# EAGLE design 2364 Multi-ROM Rev3 (EAGLE 9.7.0)
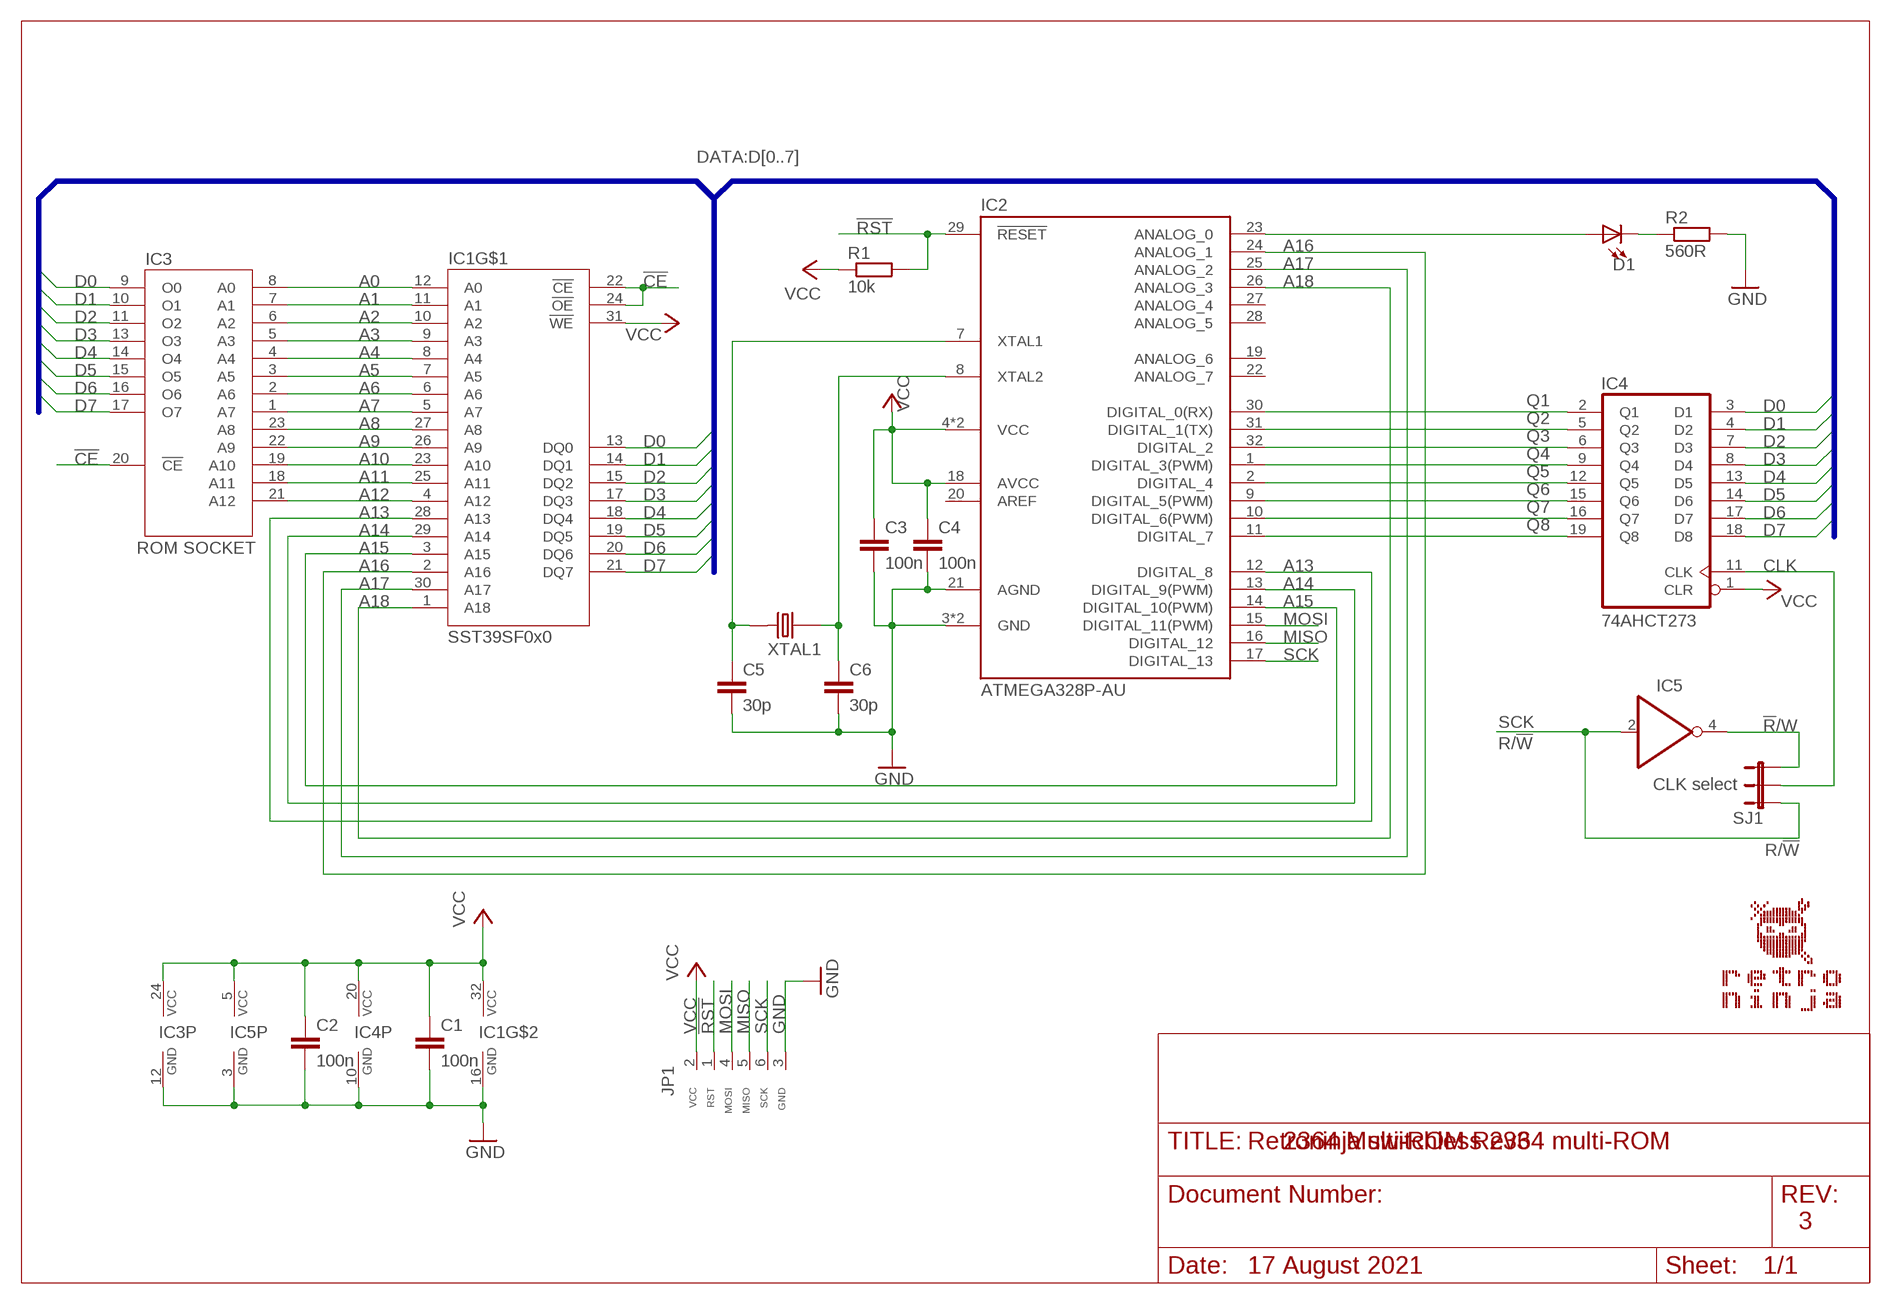
[diagram p0: schematic, sheet 1]

## Parts
C1  100n  C-EUC0805  [C0805]
C2  100n  C-EUC0805  [C0805]
C3  100n  C-EUC0805  [C0805]
C4  100n  C-EUC0805  [C0805]
C5  30p  C-EUC0805  [C0805]
C6  30p  C-EUC0805  [C0805]
D1  LED_0805  [LED0805]
IC1  SST39SF0x0  SST39XX040_PLCC_SHORT  [PLCC32_SHORT]
IC2  ATMEGA328P-AU  ARDUINO_168_328_TQFP  [TQFP32]
IC3  ROM SOCKET  2364_DOWNPINS  [DIL24-6_DOWNPINS]
IC4  74AHCT273  74273NS  [SO20]
IC5  741G04_SOT23  [SOT23-5]
JP1  ICSP_CONNECTOR_TL866_RIGHT2  [HEADER_1X6_RIGHT]
R1  10k  R-EU_R0805  [R0805]
R2  560R  R-EU_R0805  [R0805]
SJ1  JUMPER-3SJ  [SJ-3]
XTAL1  CRYSTAL  [CRYSTAL_SMD-2_7X4X2.3]

## Nets
!CE: IC1.22(!CE) IC1.24(!OE) IC3.20(!CE)
!R!/W: IC5.4(O) SJ1.3
!RST: IC2.29(!RESET) JP1.1(RST) R1.2
A0: IC1.12(A0) IC3.8(A0)
A1: IC1.11(A1) IC3.7(A1)
A2: IC1.10(A2) IC3.6(A2)
A3: IC1.9(A3) IC3.5(A3)
A4: IC1.8(A4) IC3.4(A4)
A5: IC1.7(A5) IC3.3(A5)
A6: IC1.6(A6) IC3.2(A6)
A7: IC1.5(A7) IC3.1(A7)
A8: IC1.27(A8) IC3.23(A8)
A9: IC1.26(A9) IC3.22(A9)
A10: IC1.23(A10) IC3.19(A10)
A11: IC1.25(A11) IC3.18(A11)
A12: IC1.4(A12) IC3.21(A12)
A13: IC1.28(A13) IC2.12(DIGITAL_8)
A14: IC1.29(A14) IC2.13(DIGITAL_9(PWM))
A15: IC1.3(A15) IC2.14(DIGITAL_10(PWM))
A16: IC1.2(A16) IC2.24(ANALOG_1)
A17: IC1.30(A17) IC2.25(ANALOG_2)
A18: IC1.1(A18) IC2.26(ANALOG_3)
CLK: IC4.11(CLK) SJ1.2
D0: IC1.13(DQ0) IC3.9(O0) IC4.3(D1)
D1: IC1.14(DQ1) IC3.10(O1) IC4.4(D2)
D2: IC1.15(DQ2) IC3.11(O2) IC4.7(D3)
D3: IC1.17(DQ3) IC3.13(O3) IC4.8(D4)
D4: IC1.18(DQ4) IC3.14(O4) IC4.13(D5)
D5: IC1.19(DQ5) IC3.15(O5) IC4.14(D6)
D6: IC1.20(DQ6) IC3.16(O6) IC4.17(D7)
D7: IC1.21(DQ7) IC3.17(O7) IC4.18(D8)
GND: C1.2 C2.2 C3.2 C4.2 C5.2 C6.2 IC1.16(GND) IC2.3(GND) IC2.5(GND) IC2.21(AGND) IC3.12(GND) IC4.10(GND) IC5.3(GND) JP1.3(GND) R2.2
MISO: IC2.16(DIGITAL_12) JP1.5(MISO)
MOSI: IC2.15(DIGITAL_11(PWM)) JP1.4(MOSI)
N$16: C6.1 IC2.8(XTAL2) XTAL1.1
N$17: C5.1 IC2.7(XTAL1) XTAL1.2
N$25: D1.A IC2.23(ANALOG_0)
N$26: D1.C R2.1
Q1: IC2.30(DIGITAL_0(RX)) IC4.2(Q1)
Q2: IC2.31(DIGITAL_1(TX)) IC4.5(Q2)
Q3: IC2.32(DIGITAL_2) IC4.6(Q3)
Q4: IC2.1(DIGITAL_3(PWM)) IC4.9(Q4)
Q5: IC2.2(DIGITAL_4) IC4.12(Q5)
Q6: IC2.9(DIGITAL_5(PWM)) IC4.15(Q6)
Q7: IC2.10(DIGITAL_6(PWM)) IC4.16(Q7)
Q8: IC2.11(DIGITAL_7) IC4.19(Q8)
SCK: IC2.17(DIGITAL_13) IC5.2(I) JP1.6(SCK) SJ1.1
VCC: C1.1 C2.1 C3.1 C4.1 IC1.31(!WE) IC1.32(VCC) IC2.4(VCC) IC2.6(VCC) IC2.18(AVCC) IC3.24(VCC) IC4.1(CLR) IC4.20(VCC) IC5.5(VCC) JP1.2(VCC) R1.1
Unconnected: IC2.19(ANALOG_6) IC2.20(AREF) IC2.22(ANALOG_7) IC2.27(ANALOG_4) IC2.28(ANALOG_5)

## Buses
DATA:D[0..7]

## Notes on the sheet
- R/!W
- CLK select
- R/!W
- Retroninja switchless 2364 multi-ROM
- 3
- 17 August 2021

## Library data of the parts
C1-C6 = rcl:C-EU: CAPACITOR, European symbol; SPICEPREFIX: C
D1 = Per (Fusion 360):LED
IC1 = Per (Fusion 360):SST39XX040
IC2 = Per (Fusion 360):ARDUINO_168_328
IC3 = Per (Fusion 360):2364
IC4 = Per (Fusion 360):74*273
IC5 = Per (Fusion 360):74*1G04
JP1 = Per (Fusion 360):ICSP_CONNECTOR: PIN HEADER
R1 R2 = rcl:R-EU_: RESISTOR, European symbol; SPICEPREFIX: R
SJ1 = Per (Fusion 360):JUMPER-3
XTAL1 = Per (Fusion 360):CRYSTAL

## Board
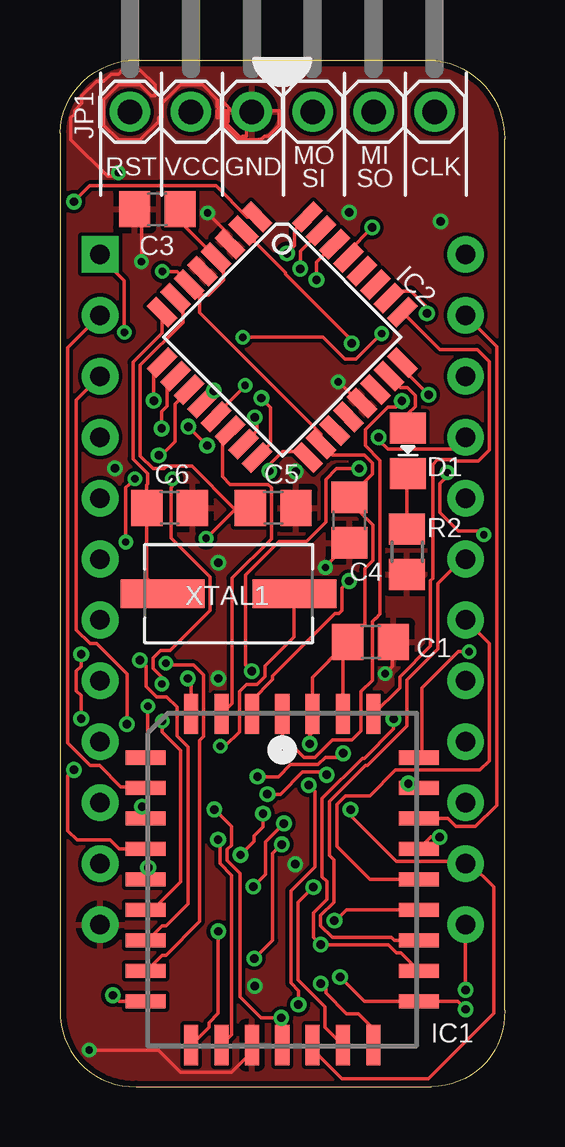
[diagram p1: board, top side]
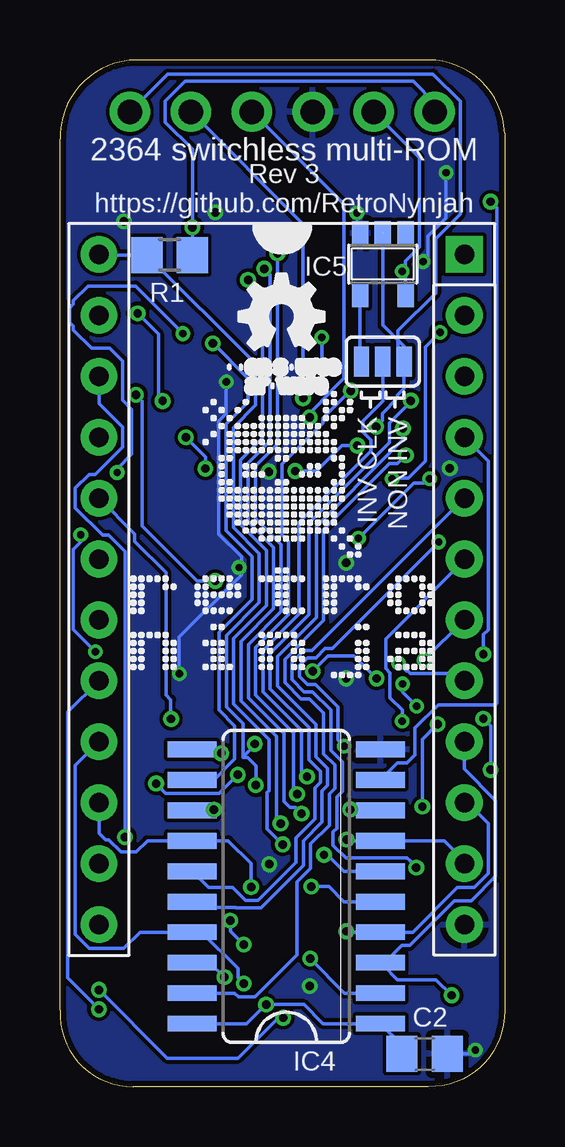
[diagram p2: board, bottom side, seen from below]

Size 18.54 x 42.8 mm. Coordinates in mm from the lower left corner, seen from the top.
Outline: 3.17,0 15.49,0 arc92 18.54,3.17 18.54,39.5 arc90 15.37,42.8 3.17,42.8 arc88 0,39.75 0,3.17 arc92 3.17,0
Copper layers (1*16): Top 0.035mm / dielectric 1.5mm / Bottom 0.035mm
Design rules "SeeedStudio_2layer_DRU_no_angle_20140221": minimum track width 6mil, minimum drill 12mil, track to track 6mil, track to pad 6mil, pad to pad 6mil, via to via 6mil, smd to smd 0mil, copper to edge 10mil, drill to drill 10mil, minimum pad ring 10mil, minimum via ring 6mil, stop-mask expansion 2mil, vias tented up to drill 100mil, thermal gap 10mil

### Footprints (pad centres in the part's own frame; a part is rotated, then mirrored left to right if it is on the bottom)
C0805 = smd 1.3 x 1.5: 1 -0.95,0; 2 0.95,0
LED0805 = smd 1.3 x 1.5: A -0.95,0; C 0.95,0
PLCC32_SHORT = smd 0.584 x 1.676: 1 0,6.9; 2 -1.27,6.9; 3 -2.54,6.9; 4 -3.81,6.9; 14 -3.81,-6.9; 15 -2.54,-6.9; 16 -1.27,-6.9; 17 0,-6.9; 18 1.27,-6.9; 19 2.54,-6.9; 20 3.81,-6.9; 30 3.81,6.9; 31 2.54,6.9; 32 1.27,6.9 | smd 1.676 x 0.584: 5 -5.7,5.08; 6 -5.7,3.81; 7 -5.7,2.54; 8 -5.7,1.27; 9 -5.7,0; 10 -5.7,-1.27; 11 -5.7,-2.54; 12 -5.7,-3.81; 13 -5.7,-5.08; 21 5.7,-5.08; 22 5.7,-3.81; 23 5.7,-2.54; 24 5.7,-1.27; 25 5.7,0; 26 5.7,1.27; 27 5.7,2.54; 28 5.7,3.81; 29 5.7,5.08
TQFP32 = smd 1.27 x 0.559: 1 -4.293,2.8; 2 -4.293,2; 3 -4.293,1.2; 4 -4.293,0.4; 5 -4.293,-0.4; 6 -4.293,-1.2; 7 -4.293,-2; 8 -4.293,-2.8; 17 4.293,-2.8; 18 4.293,-2; 19 4.293,-1.2; 20 4.293,-0.4; 21 4.293,0.4; 22 4.293,1.2; 23 4.293,2; 24 4.293,2.8 | smd 0.559 x 1.27: 9 -2.8,-4.293; 10 -2,-4.293; 11 -1.2,-4.293; 12 -0.4,-4.293; 13 0.4,-4.293; 14 1.2,-4.293; 15 2,-4.293; 16 2.8,-4.293; 25 2.8,4.293; 26 2,4.293; 27 1.2,4.293; 28 0.4,4.293; 29 -0.4,4.293; 30 -1.2,4.293; 31 -2,4.293; 32 -2.8,4.293
DIL24-6_DOWNPINS = drill 0.813 pad 1.524 square: 1 -15.24,-7.62 | drill 0.813 pad 1.524: 2 -12.7,-7.62; 3 -10.16,-7.62; 4 -7.62,-7.62; 5 -5.08,-7.62; 6 -2.54,-7.62; 7 0,-7.62; 8 2.54,-7.62; 9 5.08,-7.62; 10 7.62,-7.62; 11 10.16,-7.62; 12 12.7,-7.62; 13 12.7,7.62; 14 10.16,7.62; 15 7.62,7.62; 16 5.08,7.62; 17 2.54,7.62; 18 0,7.62; 19 -2.54,7.62; 20 -5.08,7.62; 21 -7.62,7.62; 22 -10.16,7.62; 23 -12.7,7.62; 24 -15.24,7.62
SO20 = smd 0.66 x 2.032: 1 -5.369,-4.019; 2 -4.099,-4.019; 3 -2.829,-4.019; 4 -1.559,-4.019; 5 -0.289,-4.019; 6 0.981,-4.019; 7 2.251,-4.019; 8 3.521,-4.019; 9 4.791,-4.019; 10 6.061,-4.019; 11 6.061,3.839; 12 4.791,3.839; 13 3.521,3.839; 14 2.251,3.839; 15 0.981,3.839; 16 -0.289,3.839; 17 -1.559,3.839; 18 -2.829,3.839; 19 -4.099,3.839; 20 -5.369,3.839
SOT23-5 = smd 0.69 x 0.99: 1 -0.95,-1.29; 2 0,-1.29; 3 0.95,-1.29; 4 0.95,1.3; 5 -0.95,1.3
HEADER_1X6_RIGHT = drill 1.016 pad 1.676: 1 -6.35,-1.27; 2 -3.81,-1.27; 3 -1.27,-1.27; 4 1.27,-1.27; 5 3.81,-1.27; 6 6.35,-1.27
R0805 = smd 1.3 x 1.5: 1 -0.95,0; 2 0.95,0
SJ-3 = smd 0.635 x 1.27: 1 -0.889,0; 2 0,0; 3 0.889,0
CRYSTAL_SMD-2_7X4X2.3 = smd 3.5 x 1.2: 1 -2.75,0; 2 2.75,0

### Placement (x,y rotation side)
C1  12.95,18.54 0 top
C2  3.34,1.36 0 bottom
C3  4.06,36.58 180 top
C4  12.06,23.62 270 top
C5  8.89,24.13 0 top
C6  4.57,24.13 0 top
D1  14.52,26.5 270 top
IC1  9.27,8.64 0 top
IC2  9.27,31.24 315 top
IC3  9.3,19.46 270 top
IC4  9.19,8 90 bottom
IC5  5.08,34.29 180 bottom
JP1  9.27,41.91 0 top
R1  13.97,34.67 0 bottom
R2  14.48,22.3 270 top
SJ1  5.08,30.23 180 bottom
U$1  [RETRONINJA_12MM]  15.62,17.02 0 bottom
U$2  [OSHW_5MM]  11.68,28.96 0 bottom
XTAL1  7.04,20.55 0 top

### Tracks (layer width: path | path; a pad name or v marks a point on that pad's centre or on a via)
!CE  (via drill 0.35)
  Top 0.152: IC1.22 14.22,5.58 14.04,5.58 13.7,5.92 v10.87,5.92 10.57,6.22 10.57,7.26 11.13,7.82 11.13,8.55 10.94,8.74 10.94,12.02 12.61,13.69 12.69,13.69 13.91,14.91 v13.91,15.33 | IC1.24 11.94,7.37 11.49,6.92 v11.45,6.92
  Bottom 0.152: IC3.20 15.42,23.04 15.42,22.73 14.12,21.43 14.12,16.32 13.93,16.13 13.93,15.35 v13.91,15.33 | v10.87,5.92 11.43,6.48 11.43,6.9 v11.45,6.92
!R!/W
  Bottom 0.152: SJ1.3 6.03,30.29 IC5.4
!RST  (via drill 0.35)
  Top 0.152: IC2.29 12.02,34.82 v13.02,35.81
  Bottom 0.152: R1.2 v13.02,35.81 13.02,39.07 14.15,40.2 14.15,41.08 13.32,41.91 3.81,41.91 2.92,41.02 JP1.1
A0  (via drill 0.3)
  Top 0.152: IC1.12 3.66,4.88 4.27,5.49 4.42,5.49 5.82,6.88 5.82,14.44 5.98,14.6 5.98,17.16 5.56,17.57 4.5,17.57 v4.42,17.65
  Bottom 0.152: IC3.8 1.98,17.22 3.92,17.22 4.02,17.32 4.1,17.32 v4.42,17.65
A1  (via drill 0.35)
  Top 0.152: IC1.11 3.66,6.1 4.27,6.71 4.42,6.71 5.33,7.62 5.33,14.17 4.88,14.63 4.88,15.82 4.45,16.26 4.02,16.26 3.58,16.7 3.58,17.53 v3.33,17.78
  Bottom 0.152: IC3.7 3.33,17.8 v3.33,17.78
A2  (via drill 0.3)
  Top 0.152: v4.27,15.24 4.27,14.78 5.03,14.02 5.03,8.53 3.96,7.47 3.66,7.47 IC1.10
  Bottom 0.152: v4.27,15.24 4.27,15.7 4.78,16.21 4.78,17.25 4.96,17.43 4.96,18.66 1.68,21.95 IC3.6
A3  (via drill 0.35)
  Top 0.152: v3.68,9.13 3.68,8.74 IC1.9
  Bottom 0.152: v3.68,9.13 3.93,9.38 3.93,9.41 4.07,9.54 6.62,9.54 7.15,10.07 7.15,10.62 7,10.78 7,12.08 6.77,12.31 6.77,13.53 7.25,14.01 7.25,15.7 8.01,16.46 8.36,16.46 8.86,16.97 8.86,17.68 8.36,18.18 8.03,18.18 IC3.5
A4  (via drill 0.35)
  Top 0.152: IC1.8 2.47,9.91 2.09,10.29 0.71,10.29 0.33,10.67 0.33,12.96 v0.58,13.21 | v0.89,15.34 0.89,16.31 0.69,16.51 0.69,17.33 0.89,17.53 v0.89,18.03
  Bottom 0.152: v0.89,15.34 0.58,15.04 v0.58,13.21 | v0.89,18.03 0.89,18.85 0.69,19.05 0.69,26.09 IC3.4
A5  (via drill 0.35)
  Top 0.152: IC1.7 3.43,11.32 v3.43,11.67 | IC3.3 0.69,28.63 0.69,19.05 1.27,18.47 1.53,18.47 2.79,17.2 v2.79,15.11
  Bottom 0.152: v3.43,11.67 3.43,14.48 v2.79,15.11
A6
  Top 0.152: IC1.6 3.5,12.5 2.54,12.5 1.65,13.39 1.27,13.39 0.33,14.32 0.33,30.81 IC3.2
A7  (via drill 0.3)
  Top 0.152: IC3.1 1.68,34.59 2.67,33.6 2.67,31.47 v2.69,31.45 | v4.68,25.34 4.68,25.01 4.64,24.98 4.64,22.87 6.26,21.25 6.26,19.86 4.59,18.18 4.2,18.18 3.89,17.87 3.89,17.43 4.25,17.07 v4.25,16.79 | IC1.5 3.66,13.8 3.66,15.85 v3.67,15.86
  Bottom 0.152: v4.68,25.34 4.64,25.38 4.01,25.38 3.3,26.09 3.3,30.84 v2.69,31.45 | v3.67,15.86 4.25,16.44 v4.25,16.79
A8
  Top 0.152: IC1.27 16.18,11.18 16.51,10.85 17.33,10.85 18.21,11.73 18.21,30.86 IC3.23
A9  (via drill 0.35)
  Top 0.152: IC1.26 15.47,10.4 v15.83,10.4
  Bottom 0.152: IC3.22 16.92,28.48 15.93,27.49 15.93,26.67 17.07,25.53 17.33,25.53 17.91,24.95 17.91,24.13 16.77,22.99 16.51,22.99 15.83,22.31 v15.83,10.4
A10
  Top 0.152: IC3.19 16.79,22 15.76,20.97 15.76,18.25 14.48,16.96 14.48,15.05 12.81,13.39 12.73,13.39 11.24,11.89 11.24,9.64 11.43,9.45 11.43,7.69 10.87,7.13 10.87,6.7 11.35,6.22 13.82,6.22 13.95,6.1 IC1.23
A11
  Top 0.152: IC3.18 17.91,18.47 17.91,13.59 17.51,13.2 13.99,13.2 12.93,12.13 11.9,12.13 11.55,11.77 11.55,10.01 12.92,8.64 IC1.25
A12  (via drill 0.35)
  Top 0.152: IC1.4 5.46,16.89 v5.33,17.02 | v8,17.32 7.75,17.57 7.75,21.34 9.14,22.73 10.29,22.73 11.09,23.53 11.09,25.32 11.54,25.77 v12.47,25.77 | v13.29,27.07 13.29,26.96 13.67,26.57 16.41,26.57 IC3.21
  Bottom 0.152: v5.33,17.02 6.28,17.96 7.36,17.96 v8,17.32 | v13.29,27.07 12.47,26.25 v12.47,25.77
A13  (via drill 0.35)
  Top 0.152: v8.65,12.19 9.19,12.19 10.12,13.12 11.01,13.12 v11.13,13 | IC1.28 14.72,12.45 v14.53,12.64 | IC2.12 6.42,28.96 v6.42,29.01
  Bottom 0.152: v8.65,12.19 8.8,12.34 8.8,14.75 10.38,16.34 10.38,18.31 9.02,19.68 9.02,22.73 9.28,23 9.28,25.95 7.57,27.67 7.57,27.87 v6.42,29.01 | v14.53,12.64 14.28,12.39 14.28,12.37 14.14,12.23 11.9,12.23 v11.13,13
A14  (via drill 0.3)
  Top 0.152: v7.62,31.24 10.97,31.24 11.89,30.33 12.34,30.33 v13.41,31.39 | v16.15,25.6 16.15,25.45 15.85,25.15 15.85,23.93 16.61,23.16 17.53,23.16 v17.68,23.01 | v17.07,18.14 16.61,18.14 15.09,16.61 15.09,13.72 IC1.29 | IC2.13 6.52,28.01 7.72,29.21 v7.72,29.23
  Bottom 0.152: v13.41,31.39 15.39,33.38 17.37,33.38 17.98,32.77 17.98,32.61 18.14,32.46 18.14,31.85 17.98,31.7 17.98,31.55 17.22,30.79 16.46,30.79 15.93,30.25 15.93,29.08 15.93,29.07 15.93,28.61 15.54,28.23 15.54,26.36 16.15,25.76 v16.15,25.6 | v17.68,23.01 17.68,22.71 17.98,22.4 17.98,19.05 v17.07,18.14 | v7.62,31.24 7.62,29.35 7.72,29.25 v7.72,29.23
A15
  Top 0.152: IC2.14 6.78,27.05 6.78,25.43 7.1,25.11 8.69,25.11 8.82,24.98 8.82,22.84 7.18,21.2 7.18,15.98 IC1.3
A16  (via drill 0.35)
  Top 0.152: v12.06,21.08 11.76,20.78 11.76,19.86 11.63,19.72 11.46,19.72 8.86,17.12 8.86,16.97 8,16.11 IC1.2 | v15.37,28.84 14.29,29.93 IC2.24
  Bottom 0.152: v12.06,21.08 12.83,21.08 15.11,23.37 15.11,28.59 v15.37,28.84
A17
  Top 0.152: IC1.30 14.17,16.63 14.17,17.09 15.46,18.37 15.46,21.09 15.54,21.18 15.54,25.94 15.74,26.14 16.45,26.14 16.51,26.09 17.45,26.09 17.91,26.54 17.91,30.23 17.4,30.73 15.85,30.73 IC2.25
A18  (via drill 0.35)
  Top 0.152: IC2.26 13.75,32.86 14.06,33.17 14.63,33.17 15.3,32.5 v15.3,32.24 | IC1.1 9.27,14.64 10.18,13.73 10.64,13.73 11.36,14.45 12.18,14.45 12.56,14.83 12.56,16.47 13.03,16.93 13.03,19.39 13.16,19.52 13.17,19.52 13.35,19.7 13.35,26.11 12.73,26.73 12.73,27.39 13.67,28.33 14.01,28.33 v14.26,28.58
  Bottom 0.152: v15.3,32.24 14.43,31.37 14.43,28.76 v14.26,28.58
CLK  (via drill 0.35)
  Top 0.152: v11.81,13.9 11.64,13.73 11.07,13.73 10.77,13.43 9.62,13.43 9.12,12.92 v8.24,12.92
  Bottom 0.152: IC4.11 13.03,14.03 12.18,14.03 12.04,13.9 v11.81,13.9 | SJ1.2 5.08,28.57 5.91,27.75 5.91,27.28 5.58,26.96 5.58,26.5 8.56,23.51 8.56,19.7 10.08,18.19 10.08,16.46 8.47,14.85 8.47,13.15 v8.24,12.92
D0  (via drill 0.35)
  Top 0.152: v2.21,3.81 2.46,3.56 IC1.13
  Bottom 0.152: 5.08,5.08 IC4.3 | 5.08,5.08 4.46,4.46 2.86,4.46 v2.21,3.81 | 5.08,5.08 4.28,5.88 3.95,5.88 2.09,7.75 1.39,7.75 0.38,8.76 0.38,11.94 1.68,13.24 IC3.9
D1  (via drill 0.35)
  Top 0.152: IC1.14 6.21,2.48 6.21,2.67 6.6,3.06 v6.6,6.48
  Bottom 0.152: IC3.10 1.54,11.84 0.69,10.98 0.69,8.89 1.27,8.31 1.96,8.31 3.82,6.44 IC4.4 6.57,6.44 v6.6,6.48
D2  (via drill 0.35)
  Top 0.152: IC1.15 7.16,2.17 7.16,8.82 6.67,9.31 6.67,10.22 v6.59,10.3
  Bottom 0.152: IC3.11 1.68,9.42 2.5,10.25 IC4.7 6.54,10.25 v6.59,10.3
D3  (via drill 0.35)
  Top 0.152: IC1.17 9.27,2.96 9.23,3 v9.23,2.87 8.39,2.87 7.51,3.75 7.51,8.9 6.97,9.43 6.97,9.89 7.15,10.07 7.15,10.85 v6.44,11.56 | v16.92,4.04 IC3.13
  Bottom 0.152: v16.92,4.04 14.07,1.19 11.12,1.19 9.27,3.05 9.23,3.01 v9.23,2.87 | IC4.8 6.41,11.52 v6.44,11.56
D4  (via drill 0.35)
  Top 0.152: IC1.18 10.54,1.55 11.76,0.33 15.36,0.33 18.09,3.06 18.09,8.33 17.12,9.3 IC3.14 16.83,9.38 14.04,9.38 12.12,11.3 v12.12,11.55
  Bottom 0.152: IC4.13 13.01,11.55 v12.12,11.55
D5  (via drill 0.35)
  Top 0.152: IC1.19 11.06,2.48 11.06,3.32 9.94,4.45 9.94,7.69 v10.57,8.32
  Bottom 0.152: IC3.15 16.92,10.57 16.64,10.29 16.51,10.29 16,9.78 15.37,9.78 14.89,10.25 IC4.14 11.52,10.25 10.57,9.3 v10.57,8.32
D6  (via drill 0.35)
  Top 0.152: IC1.20 13.08,2.41 12.45,3.05 11.95,3.05 11.09,3.91 11.09,4.08 v10.87,4.29
  Bottom 0.152: IC3.16 17.91,13.39 17.91,6.35 17.33,5.77 15.88,5.77 15.2,6.44 IC4.17 12.63,6.44 11.12,4.93 11.12,4.55 v10.87,4.29
D7  (via drill 0.35)
  Top 0.152: v16.92,3.23 16.59,3.56 IC1.21 12.7,3.56 v11.68,4.57
  Bottom 0.152: IC4.18 12.29,5.17 11.7,4.57 v11.68,4.57 | IC3.17 18.21,15.62 18.21,4.54 16.92,3.25 v16.92,3.23
GND  (via drill 0.3, 0.35)
  Top 0.152: v13.56,17.22 13.87,17.53 13.87,18.44 C1.2 | IC2.21 12.5,28.5 12.19,28.8 v11.61,29.39 | IC2.3 7.01,35.2 7.01,35.57 v6.16,36.42 | v2.44,38.1 2.29,37.95 1.98,37.95 0.46,39.47 0.46,40.39 0.61,40.54 0.61,40.69 0.91,41 0.91,41.3 1.52,41.91 1.83,41.91 2.13,42.22 2.44,42.22 2.59,42.37 3.35,42.37 3.96,41.76 3.96,41.3 3.81,41.3 3.35,41.76 2.44,41.76 1.83,41.15 1.83,40.08 2.44,39.47 3.35,39.47 4.12,40.23 4.12,40.39 4.27,40.39 4.27,41 5.03,41.76 5.94,41.76 6.55,41.15 6.55,40.84 6.71,40.69 6.71,40.39 6.55,40.39 6.55,40.69 6.86,41 7.16,40.69 7.62,40.69 7.77,40.54 7.77,39.62 7.62,39.62 7.47,39.47 6.86,40.08 7.01,40.23 7.01,40.69 6.86,40.69 6.86,40.23 7.62,39.47 8.38,39.47 8.53,39.62 8.69,39.62 9.14,40.08 9.14,40.69 8.08,40.69 JP1.3 | v1.22,1.52 4.12,1.52 5.03,0.61 7.16,0.61 7.92,1.37 7.92,1.68 IC1.16 | C3.2 3.4,36.29 v3.4,34.39 | C4.2 11.07,21.68 v11.07,21.64
  Bottom 0.152: v13.56,17.22 13.56,18.75 10.97,21.34 10.97,21.64 | v1.22,1.52 1.37,1.37 2.29,1.37 C2.2 | v3.4,34.39 3.2,34.59 3.2,35.45 2.44,36.21 v2.44,38.1 | 10.97,21.64 10.97,22.1 11.92,23.05 11.92,27.74 11.61,28.05 v11.61,29.39 | 10.97,21.64 v11.07,21.64 | IC5.3 6.03,35.75 6.16,35.87 v6.16,36.42
  other vias: 15.88,36.07 8.13,4.19 2.29,25.78 6.6,21.84 6.6,17.02 9.84,25.64 12.06,36.45 9.81,9.27
  pour Top: 0.08,0.08 18.47,0.08 18.47,42.85 0.08,42.85
  pour Bottom: 0.08,0.08 18.47,0.08 18.47,42.85 0.08,42.85
MISO  (via drill 0.35)
  Top 0.152: IC2.16 8.79,26.8 8.79,28.32 v8.4,28.7
  Bottom 0.152: JP1.5 8.4,35.96 v8.4,28.7
MOSI  (via drill 0.35)
  Top 0.152: IC2.15 8.21,27.35 8.21,27.81 v8.12,27.9
  Bottom 0.152: JP1.4 6.69,36.79 6.69,29.53 7.19,29.03 7.19,29.01 8.12,28.08 v8.12,27.9
N$16
  Top 0.152: XTAL1.1 3.62,21.21 C6.1 3.62,25.08 3.66,25.12 3.66,25.56 3.05,26.17 3.05,30.2 4.26,31.41 IC2.8
N$17  (via drill 0.3)
  Top 0.152: IC2.7 5.2,32.48 5.2,32.45 5.13,32.52 5.13,31.86 3.35,30.08 3.35,26.29 3.89,25.76 4.35,25.76 4.46,25.87 5.5,25.87 7.25,24.13 C5.1 7.32,24.08 v6.1,22.86 | XTAL1.2 9.75,20.42 9.75,18.75 8.55,17.55 8.55,17.09 8.23,16.77 7.78,16.77 7.48,16.47 7.48,14.8 6.88,14.2 v6.68,14.2 | v3.12,25.34 2.9,25.11 2.88,25.11 2.74,24.98 v2.74,22.71 | v2.74,22.71
  Bottom 0.152: v6.1,22.86 3.79,25.17 3.29,25.17 v3.12,25.34 | v6.68,14.2 6.94,14.46 6.94,15.83 7.88,16.77 8.23,16.77 8.55,17.09 8.55,17.55 8.23,17.88 7.87,17.88 7.49,18.26 7.19,18.26 v2.74,22.71
N$25
  Top 0.152: IC2.23 14.2,29.14 14.49,29.14 14.82,28.81 14.82,28.35 14.52,28.05 D1.A
N$26
  Top 0.152: R2.1 14.48,25.52 D1.C
Q1  (via drill 0.35)
  Top 0.152: v8.1,5.34 8.12,5.34 8.87,6.1 8.87,9.72 v9.25,10.1 | v10.7,33.63 10.7,34.36 IC2.30
  Bottom 0.152: IC4.2 6.67,3.9 8.1,5.33 v8.1,5.34 | v9.25,10.1 9.9,10.74 9.9,12.26 9.82,12.34 9.82,14.48 11.3,15.96 11.3,18.69 9.93,20.06 9.93,22.35 11.01,23.43 11.01,26.12 10.08,27.04 10.08,33.02 v10.7,33.63
Q2  (via drill 0.35)
  Top 0.152: v9.34,10.97 | v10.03,34.1 10.03,34.83 IC2.31 | v8.06,8.35 8.57,8.85 8.57,10.2 v9.34,10.97
  Bottom 0.152: IC4.5 6.7,7.71 7.33,8.35 v8.06,8.35 | v9.34,10.97 9.51,11.15 9.51,14.6 10.99,16.08 10.99,18.56 9.63,19.93 9.63,22.48 10.7,23.55 10.7,26 9.78,26.92 9.78,33.85 v10.03,34.1
Q3  (via drill 0.35)
  Top 0.152: IC2.32 9.78,35.71 9.78,35.05 v9.47,34.74 | v8.47,11.38 8.47,10.83 8.1,10.46 8.1,10.23 v7.53,9.66
  Bottom 0.152: IC4.6 6.7,8.98 7.38,9.66 v7.53,9.66 | v8.47,11.38 8.72,11.64 8.95,11.64 9.21,11.9 9.21,14.73 10.69,16.21 10.69,18.44 9.32,19.8 9.32,22.61 10.39,23.68 10.39,25.87 9.47,26.8 v9.47,34.74
Q4  (via drill 0.35)
  Top 0.152: IC2.1 7.8,36.26 6.5,37.55 1.24,37.55 v0.58,36.89
  Bottom 0.152: IC4.9 4.46,13.5 4.07,13.5 3.73,13.83 3.73,14.96 2.77,15.92 0.38,15.92 0.33,15.97 0.33,36.64 v0.58,36.89
Q5  (via drill 0.35)
  Top 0.152: v12.16,30.99 12.16,31.12 9.41,33.87 9.41,33.93 IC2.2
  Bottom 0.152: IC4.12 12.12,12.79 11.25,13.66 11.25,15.05 11.91,15.71 11.91,18.94 10.54,20.31 10.54,22.1 11.61,23.18 11.61,27.61 10.69,28.53 10.69,29.52 v12.16,30.99
Q6  (via drill 0.35)
  Top 0.152: IC2.9 3.91,29.84 v3.91,28.6
  Bottom 0.152: IC4.15 12.35,8.3 11.34,8.3 10.8,7.76 10.29,7.76 8.7,9.36 8.7,10.37 7.91,11.15 7.91,12.46 7.68,12.69 7.68,13.15 8.16,13.63 8.16,14.98 9.77,16.59 9.77,18.06 8.15,19.68 8.15,23.5 4.98,26.67 4.8,26.86 4.8,27.67 3.91,28.55 v3.91,28.6
Q7  (via drill 0.35)
  Top 0.152: v4.24,27.44 4.24,28.14 4.46,28.37 4.46,29.26 IC2.10
  Bottom 0.152: v4.24,27.44 4.24,26.98 4.67,26.54 4.67,26.53 7.85,23.36 7.85,19.55 9.47,17.93 9.47,16.71 7.86,15.1 7.86,13.76 7.38,13.28 7.38,12.56 7.61,12.34 7.61,11.03 8.39,10.24 8.39,9.23 10.16,7.46 11.2,7.46 11.21,7.47 12.8,7.47 IC4.16
Q8  (via drill 0.35)
  Top 0.152: IC2.11 4.8,28.46 4.8,26.9 4.21,26.31 v4.12,26.31
  Bottom 0.152: v4.12,26.31 4.47,25.97 4.81,25.97 7.54,23.23 7.54,19.43 9.16,17.81 9.16,16.84 8.48,16.16 8.14,16.16 7.55,15.57 7.55,13.88 7.07,13.4 7.07,12.44 7.3,12.21 7.3,10.9 8.09,10.12 8.09,9.11 8.66,8.54 8.66,5.5 10.41,3.74 11.1,3.74 11.27,3.9 IC4.19
SCK  (via drill 0.35)
  Top 0.152: v5.35,27.51 | v5.35,27.51 v6.14,26.73 | IC2.17 10.07,26.48 9.29,26.48 8.73,25.92 v8.73,25.66
  Bottom 0.152: SJ1.1 4.15,30.26 4.15,30.83 5.08,31.76 IC5.2 | JP1.6 14.05,42.22 2.99,42.22 1.85,41.08 1.85,36.37 2.87,35.35 2.87,33.09 4.45,31.51 4.45,30.48 SJ1.1 | v5.35,27.51 5.1,27.77 5.1,28.07 4.46,28.7 4.46,28.83 4.19,29.1 SJ1.1 | v6.14,26.73 6.78,26.73 7.84,25.66 v8.73,25.66
VCC  (via drill 0.3, 0.35)
  Top 0.152: C3.1 5.01,36.06 IC2.4 6.83,34.25 6.83,33.62 6.2,32.99 5.82,32.99 | 5.82,32.99 IC2.6 5.33,33.53 4.88,33.98 v4.27,33.98 | 11.81,18.35 IC1.31 | 11.81,18.35 C1.1 12.72,19.26 12.72,21.6 13.04,21.93 13.04,23.42 12.06,24.39 C4.1 12.7,25.21 12.71,25.21 13.03,25.54 13.03,26 12.71,26.32 11.36,26.32 IC2.18 10.89,27.2 5.82,32.27 5.82,32.99 | 11.81,18.35 11.23,17.77 11.23,17.74 10.54,17.05 IC1.32 10.54,14.76 10.41,14.63 v10.41,14.29 | v10.37,12.57 10.63,12.31 10.63,9.16 9.63,8.17 9.63,4.32 9.95,4.01 v9.95,3.42
  Bottom 0.152: IC3.24 16.89,34.67 R1.1 10.39,30.14 10.39,28.41 11.31,27.49 11.31,23.3 10.24,22.23 10.24,20.18 11.6,18.82 11.6,15.83 10.91,15.14 10.91,13.74 | IC5.5 4.13,33.98 | 4.13,33.98 4.13,34.42 3.56,34.99 3.56,38.73 JP1.2 | C2.1 4.29,1.74 IC4.1 7.57,2.63 8.37,3.43 v9.95,3.43 | IC4.20 10.75,2.63 v9.95,3.43 | v9.95,3.43 v9.95,3.42 | 10.91,13.74 10.59,14.06 10.59,14.11 v10.41,14.29 | 10.91,13.74 10.9,13.73 10.73,13.73 10.37,13.38 v10.37,12.57 | v4.27,33.98 4.13,33.98

### Text on the board
tPlace: RST | VCC | GND | MO / SI | MI / SO | CLK
bPlace: 2364 switchless multi-ROM | Rev 3 | https://github.com/RetroNynjah | NON INV | INV CLK